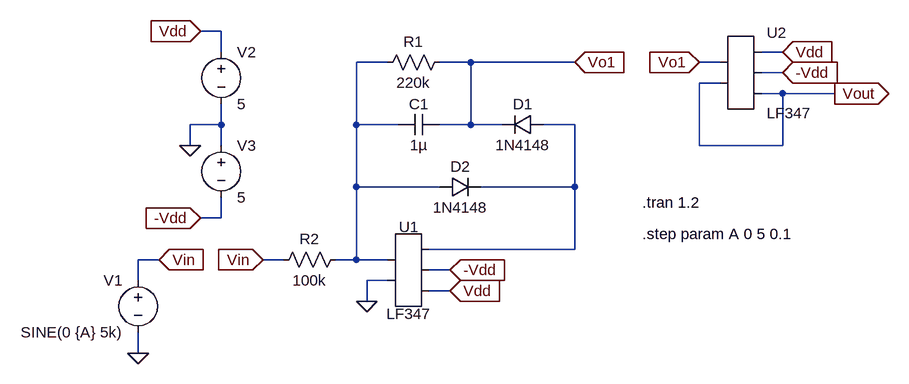
[diagram p0: schematic Q2.asc]
Q2.asc, the LTspice schematic file:
Version 4
SHEET 1 5032 680
WIRE 64 -128 32 -128
WIRE 64 -96 64 -128
WIRE 928 -96 896 -96
WIRE 320 -80 272 -80
WIRE 448 -80 400 -80
WIRE 608 -80 448 -80
WIRE 832 -80 800 -80
WIRE 928 -64 896 -64
WIRE 832 -48 800 -48
WIRE 928 -32 896 -32
WIRE 1008 -32 928 -32
WIRE 64 16 64 -16
WIRE 64 16 16 16
WIRE 272 16 272 -80
WIRE 336 16 272 16
WIRE 448 16 448 -80
WIRE 448 16 400 16
WIRE 496 16 448 16
WIRE 608 16 560 16
WIRE 16 48 16 16
WIRE 64 48 64 16
WIRE 800 48 800 -48
WIRE 928 48 928 -32
WIRE 928 48 800 48
WIRE 272 112 272 16
WIRE 400 112 272 112
WIRE 608 112 608 16
WIRE 608 112 464 112
WIRE 64 160 64 128
WIRE 64 160 32 160
WIRE 608 208 608 112
WIRE 608 208 384 208
WIRE -32 224 -64 224
WIRE 160 224 128 224
WIRE 272 224 272 112
WIRE 272 224 240 224
WIRE 320 224 272 224
WIRE 416 240 384 240
WIRE -64 256 -64 224
WIRE 320 256 288 256
WIRE 416 272 384 272
WIRE 288 288 288 256
WIRE -64 368 -64 336
FLAG 16 48 0
FLAG 32 -128 Vdd
IOPIN 32 -128 In
FLAG 32 160 -Vdd
IOPIN 32 160 In
FLAG -64 368 0
FLAG -32 224 Vin
IOPIN -32 224 In
FLAG 416 272 Vdd
IOPIN 416 272 In
FLAG 416 240 -Vdd
IOPIN 416 240 In
FLAG 928 -96 Vdd
IOPIN 928 -96 In
FLAG 928 -64 -Vdd
IOPIN 928 -64 In
FLAG 288 288 0
FLAG 128 224 Vin
IOPIN 128 224 In
FLAG 608 -80 Vo1
IOPIN 608 -80 In
FLAG 800 -80 Vo1
IOPIN 800 -80 In
FLAG 1008 -32 Vout
IOPIN 1008 -32 Out
SYMBOL voltage -64 240 M0
SYMATTR InstName V1
SYMATTR Value SINE(0 {A} 5k)
SYMBOL voltage 64 -112 R0
SYMATTR InstName V2
SYMATTR Value 5
SYMBOL voltage 64 32 R0
SYMATTR InstName V3
SYMATTR Value 5
SYMBOL AutoGenerated/LF347 352 240 M180
WINDOW 0 1 82 Bottom 2
WINDOW 3 1 -83 Top 2
SYMATTR InstName U1
SYMBOL AutoGenerated/LF347 864 -64 R0
SYMATTR InstName U2
SYMBOL res 256 208 R90
WINDOW 0 0 56 VBottom 2
WINDOW 3 32 56 VTop 2
SYMATTR InstName R2
SYMATTR Value 100k
SYMBOL diode 560 0 R90
WINDOW 0 0 32 VBottom 2
WINDOW 3 32 32 VTop 2
SYMATTR InstName D1
SYMATTR Value 1N4148
SYMBOL diode 400 96 M90
WINDOW 0 0 32 VBottom 2
WINDOW 3 32 32 VTop 2
SYMATTR InstName D2
SYMATTR Value 1N4148
SYMBOL cap 400 0 R90
WINDOW 0 0 32 VBottom 2
WINDOW 3 32 32 VTop 2
SYMATTR InstName C1
SYMATTR Value 1µ
SYMBOL res 416 -96 R90
WINDOW 0 0 56 VBottom 2
WINDOW 3 32 56 VTop 2
SYMATTR InstName R1
SYMATTR Value 220k
TEXT 712 136 Left 2 !.tran 1.2
TEXT 712 184 Left 2 !.step param A 0 5 0.1

The netlist it stands for:
* Q2.asc
V1 Vin 0 SINE(0 {A} 5k)
V2 Vdd 0 5
V3 0 -Vdd 5
* U1: LF347 (symbol AutoGenerated/LF347 not available, pins judged from their places): pin1=0 pin2=N001 pin3=Vdd pin4=-Vdd pin5=N002
* U2: LF347 (symbol AutoGenerated/LF347 not available, pins judged from their places): pin1=Vo1 pin2=Vout pin3=Vdd pin4=-Vdd pin5=Vout
R2 N001 Vin 100k
D1 N002 Vo1 1N4148
D2 N001 N002 1N4148
C1 Vo1 N001 1µ
R1 Vo1 N001 220k
.model D D
.lib standard.dio
.tran 1.2
.step param A 0 5 0.1
.backanno
.end